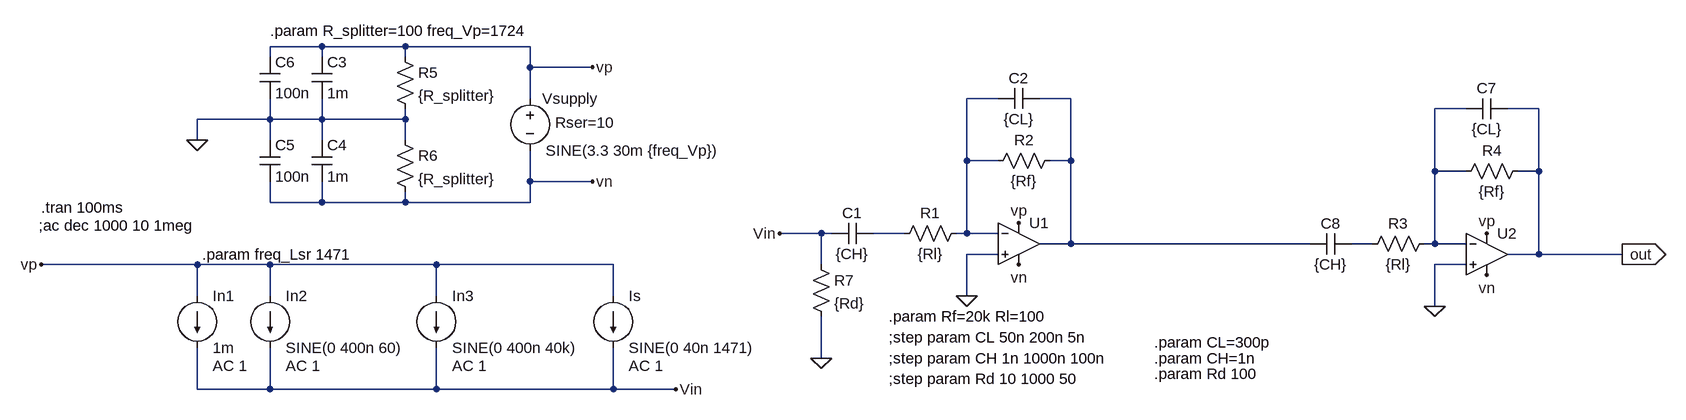
[diagram p0: schematic receiver_1A.asc]
receiver_1A.asc, the LTspice schematic file:
Version 4
SHEET 1 2336 680
WIRE 240 -256 160 -256
WIRE 368 -256 240 -256
WIRE 560 -256 368 -256
WIRE 160 -240 160 -256
WIRE 240 -240 240 -256
WIRE 368 -240 368 -256
WIRE 560 -224 560 -256
WIRE 656 -224 560 -224
WIRE 560 -176 560 -224
WIRE 1280 -176 1232 -176
WIRE 1392 -176 1344 -176
WIRE 2000 -160 1952 -160
WIRE 2112 -160 2064 -160
WIRE 160 -144 160 -176
WIRE 160 -144 48 -144
WIRE 240 -144 240 -176
WIRE 240 -144 160 -144
WIRE 368 -144 368 -160
WIRE 368 -144 240 -144
WIRE 48 -112 48 -144
WIRE 160 -112 160 -144
WIRE 240 -112 240 -144
WIRE 368 -112 368 -144
WIRE 1232 -80 1232 -176
WIRE 1280 -80 1232 -80
WIRE 1392 -80 1392 -176
WIRE 1392 -80 1360 -80
WIRE 1952 -64 1952 -160
WIRE 2000 -64 1952 -64
WIRE 2112 -64 2112 -160
WIRE 2112 -64 2080 -64
WIRE 560 -48 560 -96
WIRE 656 -48 560 -48
WIRE 160 -16 160 -48
WIRE 240 -16 240 -48
WIRE 240 -16 160 -16
WIRE 368 -16 368 -32
WIRE 368 -16 240 -16
WIRE 560 -16 560 -48
WIRE 560 -16 368 -16
WIRE 1008 32 944 32
WIRE 1024 32 1008 32
WIRE 1136 32 1088 32
WIRE 1232 32 1232 -80
WIRE 1232 32 1216 32
WIRE 1280 32 1232 32
WIRE 1392 48 1392 -80
WIRE 1392 48 1344 48
WIRE 1760 48 1392 48
WIRE 1856 48 1824 48
WIRE 1952 48 1952 -64
WIRE 1952 48 1936 48
WIRE 2000 48 1952 48
WIRE 1280 64 1232 64
WIRE 2112 64 2112 -64
WIRE 2112 64 2064 64
WIRE 2240 64 2112 64
WIRE 48 80 -192 80
WIRE 160 80 48 80
WIRE 416 80 160 80
WIRE 688 80 416 80
WIRE 1008 80 1008 32
WIRE 2000 80 1952 80
WIRE 48 128 48 80
WIRE 160 128 160 80
WIRE 416 128 416 80
WIRE 688 128 688 80
WIRE 1232 128 1232 64
WIRE 1952 144 1952 80
WIRE 1008 224 1008 160
WIRE 48 272 48 208
WIRE 160 272 160 208
WIRE 160 272 48 272
WIRE 416 272 416 208
WIRE 416 272 160 272
WIRE 688 272 688 208
WIRE 688 272 416 272
WIRE 784 272 688 272
FLAG 48 -112 0
FLAG 656 -224 vp
FLAG -192 80 vp
FLAG 656 -48 vn
FLAG 784 272 Vin
FLAG 944 32 Vin
FLAG 1232 128 0
FLAG 1312 80 vn
FLAG 1312 16 vp
FLAG 2240 64 out
IOPIN 2240 64 Out
FLAG 1008 224 0
FLAG 1952 144 0
FLAG 2032 96 vn
FLAG 2032 32 vp
SYMBOL current 48 128 R0
WINDOW 123 24 108 Left 2
WINDOW 39 0 0 Left 0
SYMATTR InstName In1
SYMATTR Value 1m
SYMATTR Value2 AC 1
SYMBOL current 160 128 R0
WINDOW 123 24 108 Left 2
WINDOW 39 0 0 Left 0
SYMATTR InstName In2
SYMATTR Value SINE(0 400n 60)
SYMATTR Value2 AC 1
SYMBOL current 416 128 R0
WINDOW 123 24 108 Left 2
WINDOW 39 0 0 Left 0
SYMATTR InstName In3
SYMATTR Value SINE(0 400n 40k)
SYMATTR Value2 AC 1
SYMBOL current 688 128 R0
WINDOW 123 24 108 Left 2
WINDOW 39 0 0 Left 0
SYMATTR InstName Is
SYMATTR Value SINE(0 40n 1471)
SYMATTR Value2 AC 1
SYMBOL voltage 560 -192 R0
WINDOW 0 19 16 Left 2
WINDOW 123 0 0 Left 0
WINDOW 39 39 53 Left 2
SYMATTR InstName Vsupply
SYMATTR Value SINE(3.3 30m {freq_Vp})
SYMATTR SpiceLine Rser=10
SYMBOL res 352 -256 R0
SYMATTR InstName R5
SYMATTR Value {R_splitter}
SYMBOL res 352 -128 R0
SYMATTR InstName R6
SYMATTR Value {R_splitter}
SYMBOL cap 224 -240 R0
SYMATTR InstName C3
SYMATTR Value 1m
SYMBOL cap 224 -112 R0
SYMATTR InstName C4
SYMATTR Value 1m
SYMBOL cap 144 -112 R0
SYMATTR InstName C5
SYMATTR Value 100n
SYMBOL cap 144 -240 R0
SYMATTR InstName C6
SYMATTR Value 100n
SYMBOL OpAmps\\UniversalOpAmp2 1312 48 R0
SYMATTR InstName U1
SYMATTR Value2 Avol=25k GBW=1Meg Slew=0.6Meg
SYMATTR SpiceLine Ilimit=6m Rail=25m Vos=0
SYMBOL res 1232 16 R90
WINDOW 0 0 56 VBottom 2
WINDOW 3 32 56 VTop 2
SYMATTR InstName R1
SYMATTR Value {Rl}
SYMBOL res 1376 -96 R90
WINDOW 0 0 56 VBottom 2
WINDOW 3 32 56 VTop 2
SYMATTR InstName R2
SYMATTR Value {Rf}
SYMBOL cap 1088 16 R90
WINDOW 0 0 32 VBottom 2
WINDOW 3 32 32 VTop 2
SYMATTR InstName C1
SYMATTR Value {CH}
SYMBOL res 992 64 R0
SYMATTR InstName R7
SYMATTR Value {Rd}
SYMBOL cap 1344 -192 R90
WINDOW 0 0 32 VBottom 2
WINDOW 3 32 32 VTop 2
SYMATTR InstName C2
SYMATTR Value {CL}
SYMBOL OpAmps\\UniversalOpAmp2 2032 64 R0
SYMATTR InstName U2
SYMATTR Value2 Avol=25k GBW=1Meg Slew=0.6Meg
SYMATTR SpiceLine Ilimit=6m Rail=25m Vos=0
SYMBOL res 1952 32 R90
WINDOW 0 0 56 VBottom 2
WINDOW 3 32 56 VTop 2
SYMATTR InstName R3
SYMATTR Value {Rl}
SYMBOL res 2096 -80 R90
WINDOW 0 0 56 VBottom 2
WINDOW 3 32 56 VTop 2
SYMATTR InstName R4
SYMATTR Value {Rf}
SYMBOL cap 2064 -176 R90
WINDOW 0 0 32 VBottom 2
WINDOW 3 32 32 VTop 2
SYMATTR InstName C7
SYMATTR Value {CL}
SYMBOL cap 1824 32 R90
WINDOW 0 0 32 VBottom 2
WINDOW 3 32 32 VTop 2
SYMATTR InstName C8
SYMATTR Value {CH}
TEXT 160 -280 Left 2 !.param R_splitter=100 freq_Vp=1724
TEXT 56 64 Left 2 !.param freq_Lsr 1471
TEXT -196 20 Left 2 !;ac dec 1000 10 1meg
TEXT 1112 160 Left 2 !.param Rf=20k Rl=100
TEXT -192 -8 Left 2 !.tran 100ms
TEXT 1112 224 Left 2 !;step param CH 1n 1000n 100n
TEXT 1520 200 Left 2 !.param CL=300p
TEXT 1520 224 Left 2 !.param CH=1n
TEXT 1112 192 Left 2 !;step param CL 50n 200n 5n
TEXT 1112 256 Left 2 !;step param Rd 10 1000 50
TEXT 1520 248 Left 2 !.param Rd 100

The netlist it stands for:
* receiver_1A.asc
In1 vp Vin 1m AC 1
In2 vp Vin SINE(0 400n 60) AC 1
In3 vp Vin SINE(0 400n 40k) AC 1
Is vp Vin SINE(0 40n 1471) AC 1
Vsupply vp vn SINE(3.3 30m {freq_Vp}) Rser=10
R5 vp 0 {R_splitter}
R6 0 vn {R_splitter}
C3 vp 0 1m
C4 0 vn 1m
C5 0 vn 100n
C6 vp 0 100n
XU1 0 N001 vp vn N002 level2 Avol=25k GBW=1Meg Slew=0.6Meg Ilimit=6m Rail=25m Vos=0 En=0 Enk=0 In=0 Ink=0 Rin=500Meg  ; pins In+ In- V+ V- OUT
R1 N001 N004 {Rl}
R2 N002 N001 {Rf}
C1 N004 Vin {CH}
R7 Vin 0 {Rd}
C2 N002 N001 {CL}
XU2 0 N003 vp vn out level2 Avol=25k GBW=1Meg Slew=0.6Meg Ilimit=6m Rail=25m Vos=0 En=0 Enk=0 In=0 Ink=0 Rin=500Meg  ; pins In+ In- V+ V- OUT
R3 N003 N005 {Rl}
R4 out N003 {Rf}
C7 out N003 {CL}
C8 N005 N002 {CH}
.param R_splitter=100 freq_Vp=1724
.param freq_Lsr 1471
;ac dec 1000 10 1meg
.param Rf=20k Rl=100
.tran 100ms
;step param CH 1n 1000n 100n
.param CL=300p
.param CH=1n
;step param CL 50n 200n 5n
;step param Rd 10 1000 50
.param Rd 100
.lib UniversalOpAmp2.lib
.backanno
.end